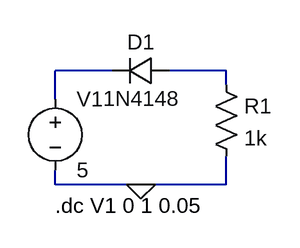
[diagram p0: schematic V I cube.asc]
V I cube.asc, the LTspice schematic file:
Version 4
SHEET 1 880 680
WIRE 240 80 176 80
WIRE 368 80 304 80
WIRE 368 96 368 80
WIRE 176 112 176 80
WIRE 176 208 176 192
WIRE 272 208 176 208
WIRE 368 208 368 176
WIRE 368 208 272 208
FLAG 272 208 0
SYMBOL diode 304 96 M270
WINDOW 0 32 32 VTop 2
WINDOW 3 0 32 VBottom 2
SYMATTR InstName D1
SYMATTR Value 1N4148
SYMBOL voltage 176 96 R0
SYMATTR InstName V1
SYMATTR Value 5
SYMBOL res 352 80 R0
SYMATTR InstName R1
SYMATTR Value 1k
TEXT 176 232 Left 2 !.dc V1 0 1 0.05

The netlist it stands for:
* V I cube.asc
D1 N002 N001 1N4148
V1 N001 0 5
R1 N002 0 1k
.model D D
.lib standard.dio
.dc V1 0 1 0.05
.backanno
.end